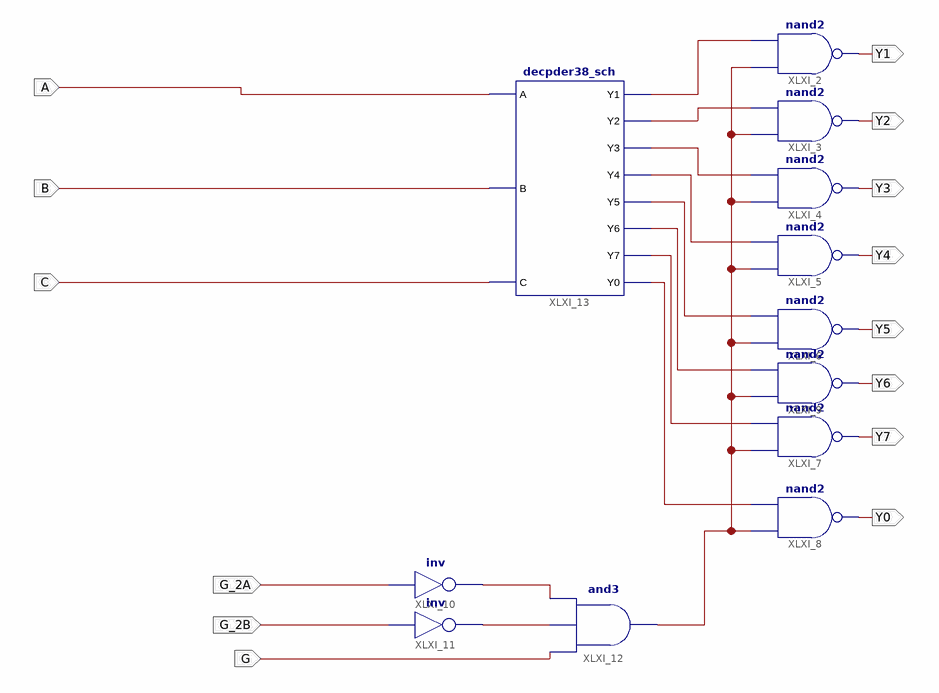
[diagram p0: schematic sheet 1]
// Xilinx ISE schematic HCT138_sch.sch (kintex7) as structural Verilog: 12 symbols, 14 ports
module HCT138_sch (
  input  C,
  input  A,
  input  G_2A,
  input  G_2B,
  input  G,
  input  B,
  output Y1,
  output Y2,
  output Y3,
  output Y4,
  output Y5,
  output Y6,
  output Y7,
  output Y0
);

  wire XLXN_10, XLXN_11, XLXN_13, XLXN_15, XLXN_16, XLXN_22, XLXN_23, XLXN_24, XLXN_25, XLXN_26, XLXN_28;

  nand XLXI_2 (Y1, XLXN_28, XLXN_13);
  nand XLXI_3 (Y2, XLXN_28, XLXN_15);
  nand XLXI_4 (Y3, XLXN_28, XLXN_16);
  nand XLXI_5 (Y4, XLXN_28, XLXN_22);
  nand XLXI_6 (Y5, XLXN_28, XLXN_23);
  nand XLXI_7 (Y7, XLXN_28, XLXN_25);
  nand XLXI_8 (Y0, XLXN_28, XLXN_26);
  nand XLXI_9 (Y6, XLXN_28, XLXN_24);
  not XLXI_10 (XLXN_11, G_2A);
  not XLXI_11 (XLXN_10, G_2B);
  and XLXI_12 (XLXN_28, G, XLXN_10, XLXN_11);
  decpder38_sch XLXI_13 (
    .A(A), .B(B), .C(C), .Y1(XLXN_13), .Y2(XLXN_15), .Y3(XLXN_16), .Y4(XLXN_22), .Y5(XLXN_23), .Y6(XLXN_24),
    .Y7(XLXN_25), .Y0(XLXN_26));
endmodule
